# Altium schematic sheet MCU.SchDoc
size 381 x 241 mm; SheetNumber: 1; SheetTotal: 2
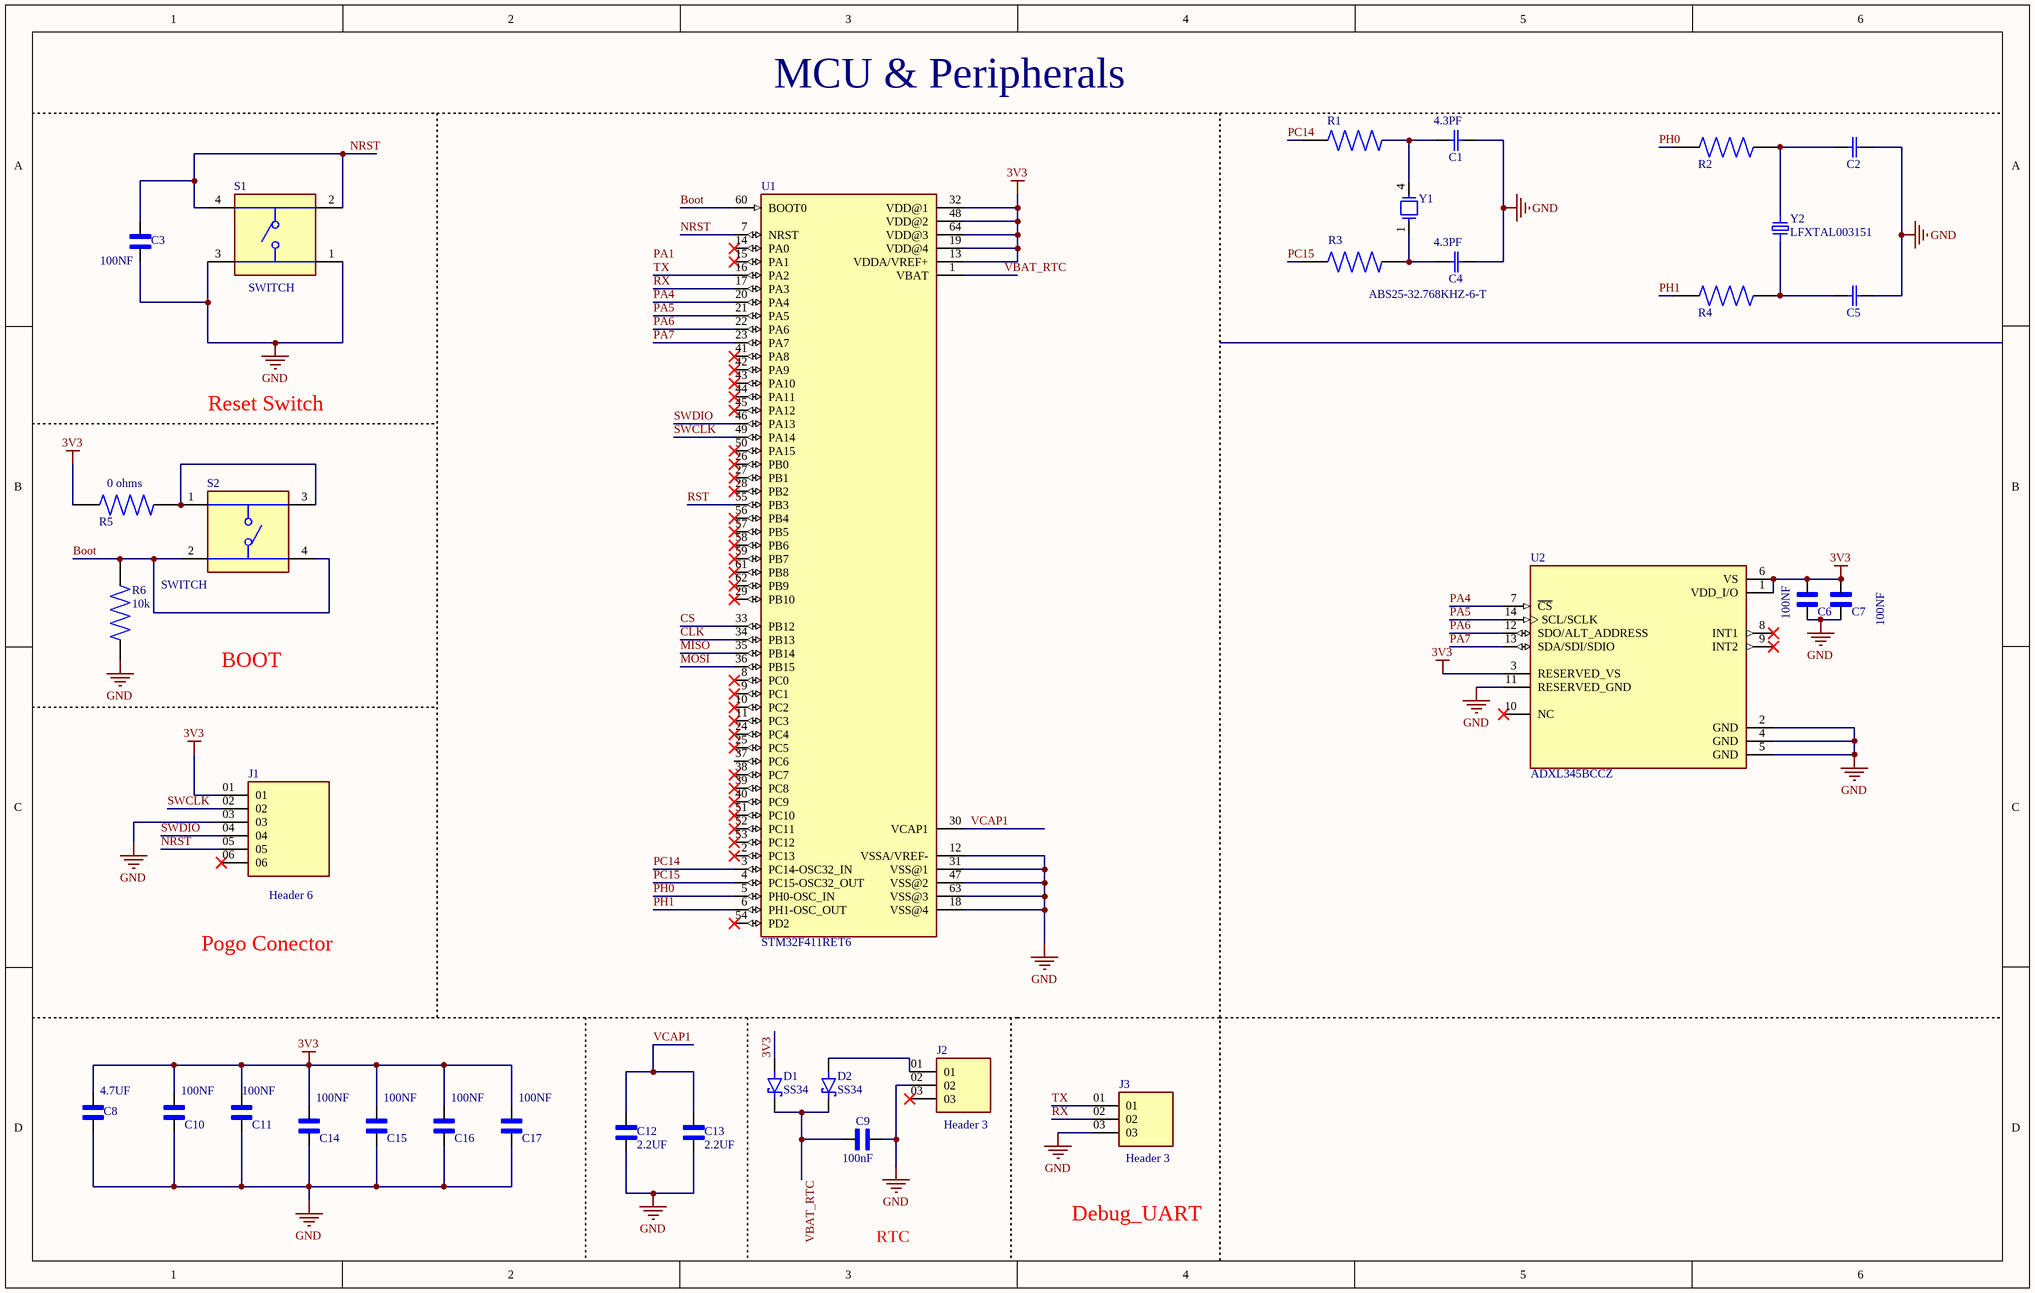
[diagram p0: MCU.SchDoc]

## Parts
C1  4.3PF  [CAPC1608X85N]
C2  C0603C200J5GACTU  [CAPC1608X85N]  (value not drawn)
C3  100NF  [CAPC1608X90]
C4  4.3PF  [CAPC1608X85N]
C5  C0603C200J5GACTU  [CAPC1608X85N]  (value not drawn)
C6  100NF  [CAPC1608X90]
C7  100NF  [CAPC1608X90]
C8  4.7UF  [CAPC2012X135N]
C9  100nF  [CAPC1608X90]
C10  100NF  [CAPC1608X90]
C11  100NF  [CAPC1608X90]
C12  2.2UF  [CAPC2012X135N]
C13  2.2UF  [CAPC2012X135N]
C14  100NF  [CAPC1608X90]
C15  100NF  [CAPC1608X90]
C16  100NF  [CAPC1608X90]
C17  100NF  [CAPC1608X90]
D1  SS34  [DIO_SS34]
D2  SS34  [DIO_SS34]
J1  Header 6  [SAMTEC_MTLW-106-06-G-S-180]
J2  Header 3  [SAMTEC_HMTSW-103-XX-X-S-XXX]
J3  Header 3  [SAMTEC_HMTSW-103-XX-X-S-XXX]
R1  AC1206FR-070RL  [RESC3116X65N]  (value not drawn)
R2  AC1206FR-070RL  [RESC3116X65N]  (value not drawn)
R3  AC1206FR-070RL  [RESC3116X65N]  (value not drawn)
R4  AC1206FR-070RL  [RESC3116X65N]  (value not drawn)
R5  0 ohms  [RESC3116X65N]
R6  10k  [RESC2012X60N]
S1  SWITCH  [SW_TS07-667-43-BK-260-SMT-TR]
S2  SWITCH  [SW_TS07-667-43-BK-260-SMT-TR]
U1  STM32F411RET6  [QFP50P1200X1200X160-64N]
U2  ADXL345BCCZ  [IC_ADXL345BCCZ]
Y1  ABS25-32.768KHZ-6-T  [XTAL_ABS25-32.768KHZ-6-T]
Y2  LFXTAL003151  [WE-XTAL_HC49/4HSMX]

## Nets
3V3: C6.2 C7.2 C8.1 C10.2 C11.2 C14.2 C15.2 C16.2 C17.2 D1.A J1.01 R5.2 U1.13(VDDA/VREF+) U1.19(VDD@4) U1.32(VDD@1) U1.48(VDD@2) U1.64(VDD@3) U2.1(VDD_I/O) U2.3(RESERVED_VS) U2.6(VS)
GND: C1.2(C2) C2.1(C1) C3.2 C4.1(C1) C5.2(C2) C6.1 C7.1 C8.2 C9.1 C10.1 C11.1 C12.2 C13.2 C14.1 C15.1 C16.1 C17.1 J1.03 J2.02 J3.03 S1.1 S1.3 U1.12(VSSA/VREF-) U1.18(VSS@4) U1.31(VSS@1) U1.47(VSS@2) U1.63(VSS@3) U2.2(GND) U2.4(GND) U2.5(GND) U2.11(RESERVED_GND)
Boot: R6.2 S2.2 S2.4 U1.60(BOOT0)
CLK: U1.34(PB13)
CS: U1.33(PB12)
MISO: U1.35(PB14)
MOSI: U1.36(PB15)
NRST: C3.1 J1.05 S1.2 S1.4 U1.7(NRST)
PA4: U1.20(PA4) U2.7(~{CS})
PA5: U1.21(PA5) U2.14(SCL/SCLK)
PA6: U1.22(PA6) U2.12(SDO/ALT_ADDRESS)
PA7: U1.23(PA7) U2.13(SDA/SDI/SDIO)
PC14: R1.1 U1.3(PC14-OSC32_IN)
PC15: R3.1 U1.4(PC15-OSC32_OUT)
PH0: R2.1 U1.5(PH0-OSC_IN)
PH1: R4.1 U1.6(PH1-OSC_OUT)
RST: U1.55(PB3)
RX: J3.02 U1.17(PA3)
SWCLK: J1.02 U1.49(PA14)
SWDIO: J1.04 U1.46(PA13)
TX: J3.01 U1.16(PA2)
VBAT_RTC: C9.2 D1.C(K) D2.C(K) U1.1(VBAT)
VCAP1: C12.1 C13.1 U1.30(VCAP1)
NetC1_1: C1.1(C1) R1.2 Y1.4
NetC2_2: C2.2(C2) R2.2 Y2.2
NetC4_2: C4.2(C2) R3.2 Y1.1
NetC5_1: C5.1(C1) R4.2 Y2.1
NetD2_A: D2.A J2.01
NetR5_1: R5.1 S2.1 S2.3

Not connected (* = marked no-connect by the designer): J1 06*; J2 03*; R6 1; U1 2(PC13)* 8(PC0)* 9(PC1)* 10(PC2)* 11(PC3)* 14(PA0)* 15(PA1)* 24(PC4)* 25(PC5)* 26(PB0)* 27(PB1)* 28(PB2)* 29(PB10)* 37(PC6) 38(PC7)* 39(PC8)* 40(PC9)* 41(PA8)* 42(PA9)* 43(PA10)* 44(PA11)* 45(PA12)* 50(PA15)* 51(PC10)* 52(PC11)* 53(PC12)* 54(PD2)* 56(PB4)* 57(PB5)* 58(PB6)* 59(PB7)* 61(PB8)* 62(PB9)*; U2 8(INT1)* 9(INT2)* 10(NC)*

## Notes on the sheet
- MCU & Peripherals
- Reset Switch
- BOOT
- Pogo Conector
- RTC
- Debug_UART
- Labels drawn without touching a wire or pin: GND, PA1

## Library data of the parts
C1 C4 = C0603C200J5GACTU: Capacitor, 4.3pF,±0.25pF,50V,COG,0603; MF: KEMET; SnapEDA_Link: https://www.snapeda.com/parts/C0603C200J5GACTU/KEMET/view-part/?ref=snap; Package: 0603 Kemet; Value: *; MP: C0603C200J5GACTU; Check_prices: https://www.snapeda.com/parts/C0603C200J5GACTU/KEMET/view-part/?ref=eda
C2 C5 = C0603C200J5GACTU: Capacitor Ceramic C0G 0603 50V 20pF | KEMET C0603C200J5GACTU; SnapEDA_Link: https://www.snapeda.com/parts/C0603C200J5GACTU/KEMET/view-part/?ref=snap; Package: 0603 Kemet; Value: *; MF: KEMET; MP: C0603C200J5GACTU; Check_prices: https://www.snapeda.com/parts/C0603C200J5GACTU/KEMET/view-part/?ref=eda
C3 C6 C7 C9-C11 C14-C17 = C0603C104J3RACTU: 0603 C 100nF Ceramic Multilayer Capacitor, 25 V, +125degC, X7R Dielectric, +/-5% | KEMET C0603C104J3RACTU; SnapEDA_Link: https://www.snapeda.com/parts/C0603C104J3RACTU/KEMET/view-part/?ref=snap; Package: 603-2 KEMET; Value: *; MF: KEMET; MP: C0603C104J3RACTU; Check_prices: https://www.snapeda.com/parts/C0603C104J3RACTU/KEMET/view-part/?ref=eda
C8 = CL21B225KPFNNNG: 4.7 µF ±10% 16V Ceramic Capacitor X7R 0805 (2012 Metric); MF: Samsung; SnapEDA_Link: https://www.snapeda.com/parts/CL21B225KPFNNNG/Samsung/view-part/?ref=snap; Package: SMD-2 Samsung; Value: *; MP: CL21B225KPFNNNG; Check_prices: https://www.snapeda.com/parts/CL21B225KPFNNNG/Samsung/view-part/?ref=eda
C12 C13 = CL21B225KPFNNNG: 2.2 ÂµF Â±10% 10V Ceramic Capacitor X7R 0805 (2012 Metric); MF: Samsung; SnapEDA_Link: https://www.snapeda.com/parts/CL21B225KPFNNNG/Samsung/view-part/?ref=snap; Package: SMD-2 Samsung; Value: *; MP: CL21B225KPFNNNG; Check_prices: https://www.snapeda.com/parts/CL21B225KPFNNNG/Samsung/view-part/?ref=eda
D1 D2 = SS34: 3A, 40V, Schottky Rectifier; MF: Taiwan Semiconductor; SnapEDA_Link: https://www.snapeda.com/parts/SS34/taiwan/view-part/?ref=snap; Package: DO-214AB-2 Taiwan Semiconductor; Value: *; MP: SS34; Check_prices: https://www.snapeda.com/parts/SS34/taiwan/view-part/?ref=eda
J1 = MTLW-106-06-G-S-180: Package: None; MP: MTLW-106-06-G-S-180; Price: None; Availability: Unavailable; Value: *
J2 J3 = HMTSW-103-XX-X-S-XXX: Connector Unshrouded Header 3 Position 2.54mm Solder Straight Through Hole; MF: Samtec; MP: HMTSW-103-10-T-S-330; SnapEDA_Link: https://www.snapeda.com/parts/HMTSW-103-10-T-S-330/Samtec/view-part/?ref=snap; Package: None; Value: *; Check_prices: https://www.snapeda.com/parts/HMTSW-103-10-T-S-330/Samtec/view-part/?ref=eda
R1-R5 = AC1206FR-070RL: 0 Ohms Jumper Chip Resistor 1206 (3216 Metric) Automotive AEC-Q200 Thick Film; MF: Yageo; SnapEDA_Link: https://www.snapeda.com/parts/AC1206FR-070RL/Yageo/view-part/?ref=snap; Package: SMD-2 Yageo; Value: *; MP: AC1206FR-070RL; Check_prices: https://www.snapeda.com/parts/AC1206FR-070RL/Yageo/view-part/?ref=eda
R6 = CR0805-JW-331ELF: 10 kOhms ±5% 0.125W, 1/8W Chip Resistor 0805 (2012 Metric) Moisture Resistant Thick Film; MF: Bourns; SnapEDA_Link: https://www.snapeda.com/parts/CR0805-JW-331ELF/Bourns/view-part/?ref=snap; Package: 0805 Bourns; Value: *; MP: CR0805-JW-331ELF; Check_prices: https://www.snapeda.com/parts/CR0805-JW-331ELF/Bourns/view-part/?ref=eda
S1 S2 = TS07-667-43-BK-260-SMT-TR: 6 x 6.7 mm, 4.3 mm Actuator Height, 260 gf, Black, Surface Mount, SPST, Tactile Switch; MF: Same Sky; SnapEDA_Link: https://www.snapeda.com/parts/TS07-667-43-BK-260-SMT-TR/Same+Sky/view-part/?ref=snap; Package: None; Value: *; MP: TS07-667-43-BK-260-SMT-TR; Check_prices: https://www.snapeda.com/parts/TS07-667-43-BK-260-SMT-TR/Same+Sky/view-part/?ref=eda
U1 = STM32F411RET6: ARMÂ® CortexÂ®-M4 STM32F4 Mikrodenetleyici IC 32-Bit Tek Ã‡ekirdek 100MHz 512KB (512K x 8) FLASH 64-LQFP (10x10); MF: STMicroelectronics; SnapEDA_Link: https://www.snapeda.com/parts/STM32F411RET6/STMicroelectronics/view-part/?ref=snap; Package: LQFP-64 STMicroelectronics; Value: *; MP: STM32F411RET6; Check_prices: https://www.snapeda.com/parts/STM32F411RET6/STMicroelectronics/view-part/?ref=eda
U2 = ADXL345BCCZ: 3-Axis, Â±2 g/Â±4 g/Â±8 g/Â±16 g Digital Accelerometer; MF: Analog Devices; SnapEDA_Link: https://www.snapeda.com/parts/ADXL345BCCZ/Analog+Devices/view-part/?ref=snap; Package: LGA -14 Analog Devices; Value: *; MP: ADXL345BCCZ; Check_prices: https://www.snapeda.com/parts/ADXL345BCCZ/Analog+Devices/view-part/?ref=eda
Y1 = ABS25-32.768KHZ-6-T: 32.768 kHz Â±20ppm Crystal 6pF 50 kOhms 4-SOJ, 5.50mm pitch; MF: Abracon; SnapEDA_Link: https://www.snapeda.com/parts/ABS25-32.768KHZ-6-T/Abracon/view-part/?ref=snap; Package: 4-4 Abracon; Value: *; MP: ABS25-32.768KHZ-6-T; Check_prices: https://www.snapeda.com/parts/ABS25-32.768KHZ-6-T/Abracon/view-part/?ref=eda
Y2 = LFXTAL003151: 8 MHz Â±30ppm Crystal 16pF 40 Ohms HC-49/US; MF: IQD Frequency Products; SnapEDA_Link: https://www.snapeda.com/parts/LFXTAL003151/IQD+Frequency+Products/view-part/?ref=snap; Package: HC-49/US IQD Frequency Products; Value: *; MP: LFXTAL003151; Check_prices: https://www.snapeda.com/parts/LFXTAL003151/IQD+Frequency+Products/view-part/?ref=eda